# Altium schematic sheet backplane.SchDoc: Backplane: Interconnect Diagram
size Letter; Engineer: Nicholas Morrow; DocumentNumber: 3; SheetNumber: 3; SheetTotal: 11; Project: GARY Synthesizer; ProjectName: GARY Synthesizer
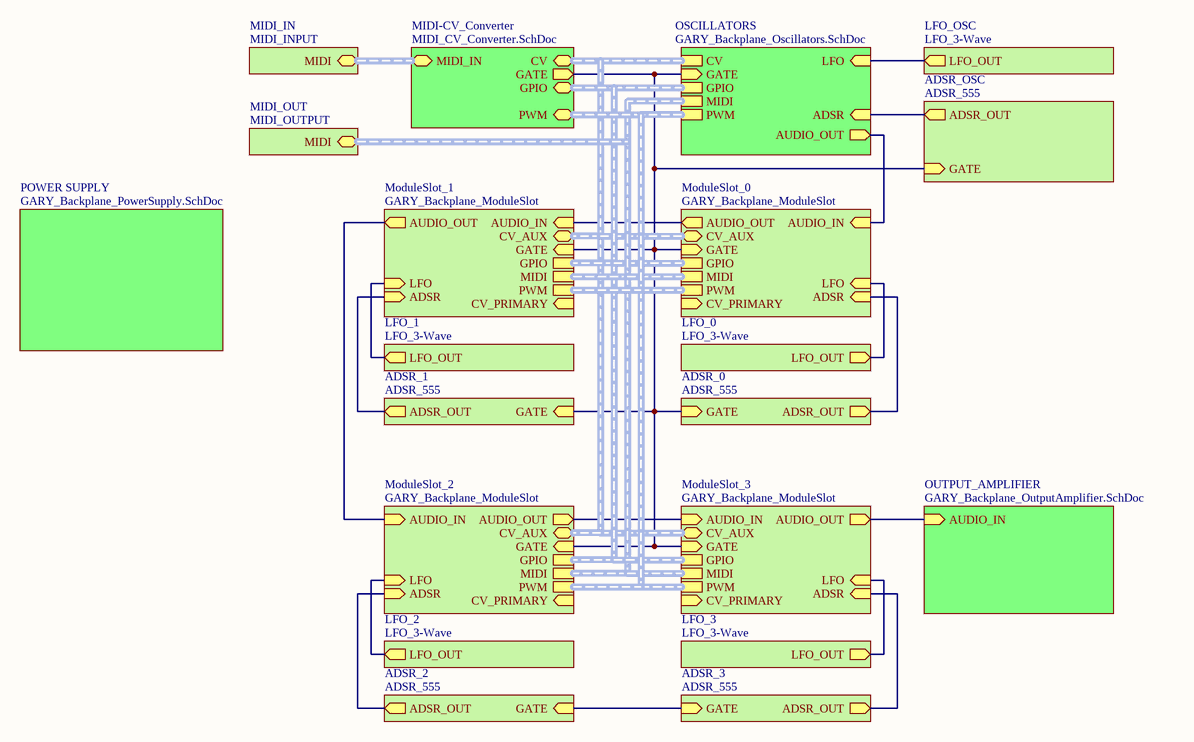
[diagram p0: backplane.SchDoc]

## Sub-sheets
ADSR_0 = ADSR_555: GATE (in), ADSR_OUT (out)
ADSR_1 = ADSR_555: GATE (in), ADSR_OUT (out)
ADSR_2 = ADSR_555: GATE (in), ADSR_OUT (out)
ADSR_3 = ADSR_555: GATE (in), ADSR_OUT (out)
ADSR_OSC = ADSR_555: GATE (in), ADSR_OUT (out)
LFO_0 = LFO_3-Wave: LFO_OUT (out)
LFO_1 = LFO_3-Wave: LFO_OUT (out)
LFO_2 = LFO_3-Wave: LFO_OUT (out)
LFO_3 = LFO_3-Wave: LFO_OUT (out)
LFO_OSC = LFO_3-Wave: LFO_OUT (out)
MIDI-CV_Converter = MIDI_CV_Converter.SchDoc: PWM (harness PWM), GPIO (harness GPIO), GATE (out), CV (harness CV_8_VOICE), MIDI_IN (harness MIDI)
MIDI_IN = MIDI_INPUT: MIDI (harness MIDI)
MIDI_OUT = MIDI_OUTPUT: MIDI (harness MIDI)
ModuleSlot_0 = GARY_Backplane_ModuleSlot: GPIO (harness GPIO), MIDI (harness MIDI), PWM (harness PWM), CV_AUX (harness CV_8_VOICE), GATE (in), AUDIO_IN (in), LFO (in), ADSR (in), AUDIO_OUT (out), CV_PRIMARY (in)
ModuleSlot_1 = GARY_Backplane_ModuleSlot: GPIO (harness GPIO), MIDI (harness MIDI), PWM (harness PWM), CV_AUX (harness CV_8_VOICE), GATE (in), AUDIO_IN (in), LFO (in), ADSR (in), AUDIO_OUT (out), CV_PRIMARY (in)
ModuleSlot_2 = GARY_Backplane_ModuleSlot: GPIO (harness GPIO), MIDI (harness MIDI), PWM (harness PWM), CV_AUX (harness CV_8_VOICE), GATE (in), AUDIO_IN (in), LFO (in), ADSR (in), AUDIO_OUT (out), CV_PRIMARY (in)
ModuleSlot_3 = GARY_Backplane_ModuleSlot: GPIO (harness GPIO), MIDI (harness MIDI), PWM (harness PWM), CV_AUX (harness CV_8_VOICE), GATE (in), AUDIO_IN (in), LFO (in), ADSR (in), AUDIO_OUT (out), CV_PRIMARY (in)
OSCILLATORS = GARY_Backplane_Oscillators.SchDoc: CV (harness CV_8_VOICE), GPIO (harness GPIO), GATE (in), MIDI (harness MIDI), PWM (harness PWM), AUDIO_OUT (out), LFO (in), ADSR (in)
OUTPUT_AMPLIFIER = GARY_Backplane_OutputAmplifier.SchDoc: AUDIO_IN (in)
POWER SUPPLY = GARY_Backplane_PowerSupply.SchDoc: no entries

## Nets
(unnamed): sheet LFO_0/LFO_OUT, sheet ModuleSlot_0/LFO
(unnamed): sheet ModuleSlot_0/GATE, sheet MIDI-CV_Converter/GATE, sheet ADSR_0/GATE, sheet OSCILLATORS/GATE, sheet ADSR_OSC/GATE, sheet ADSR_1/GATE, sheet ModuleSlot_1/GATE, sheet ModuleSlot_2/GATE, sheet ModuleSlot_3/GATE
(unnamed): sheet ModuleSlot_0/AUDIO_IN, sheet OSCILLATORS/AUDIO_OUT
(unnamed): sheet ModuleSlot_0/ADSR, sheet ADSR_0/ADSR_OUT
(unnamed): sheet ModuleSlot_0/AUDIO_OUT, sheet ModuleSlot_1/AUDIO_IN
(unnamed): sheet OSCILLATORS/LFO, sheet LFO_OSC/LFO_OUT
(unnamed): sheet OSCILLATORS/ADSR, sheet ADSR_OSC/ADSR_OUT
(unnamed): sheet OUTPUT_AMPLIFIER/AUDIO_IN, sheet ModuleSlot_3/AUDIO_OUT
(unnamed): sheet LFO_1/LFO_OUT, sheet ModuleSlot_1/LFO
(unnamed): sheet ADSR_1/ADSR_OUT, sheet ModuleSlot_1/ADSR
(unnamed): sheet LFO_2/LFO_OUT, sheet ModuleSlot_2/LFO
(unnamed): sheet ADSR_2/GATE, sheet ADSR_3/GATE
(unnamed): sheet ADSR_2/ADSR_OUT, sheet ModuleSlot_2/ADSR
(unnamed): sheet LFO_3/LFO_OUT, sheet ModuleSlot_3/LFO
(unnamed): sheet ADSR_3/ADSR_OUT, sheet ModuleSlot_3/ADSR
(unnamed): sheet ModuleSlot_1/AUDIO_OUT, sheet ModuleSlot_2/AUDIO_IN
(unnamed): sheet ModuleSlot_2/AUDIO_OUT, sheet ModuleSlot_3/AUDIO_IN

## Buses and harness runs
harness sheet MIDI-CV_Converter/CV = sheet ModuleSlot_0/CV_AUX = sheet ModuleSlot_1/CV_AUX = sheet ModuleSlot_2/CV_AUX = sheet ModuleSlot_3/CV_AUX = sheet OSCILLATORS/CV
harness sheet MIDI-CV_Converter/GPIO = sheet ModuleSlot_0/GPIO = sheet ModuleSlot_1/GPIO = sheet ModuleSlot_2/GPIO = sheet ModuleSlot_3/GPIO = sheet OSCILLATORS/GPIO
harness sheet MIDI-CV_Converter/MIDI_IN = sheet MIDI_IN/MIDI
harness sheet MIDI-CV_Converter/PWM = sheet ModuleSlot_0/PWM = sheet ModuleSlot_1/PWM = sheet ModuleSlot_2/PWM = sheet ModuleSlot_3/PWM = sheet OSCILLATORS/PWM
harness sheet MIDI_OUT/MIDI = sheet ModuleSlot_0/MIDI = sheet ModuleSlot_1/MIDI = sheet ModuleSlot_2/MIDI = sheet ModuleSlot_3/MIDI = sheet OSCILLATORS/MIDI

## Notes on the sheet
- Notes:
- Title:
- Size:
- Project:
- Letter
- Number:
- Revision:
- Date:
- Engineer:
- Sheet:
- of